# Altium schematic sheet interface.SchDoc
size A4
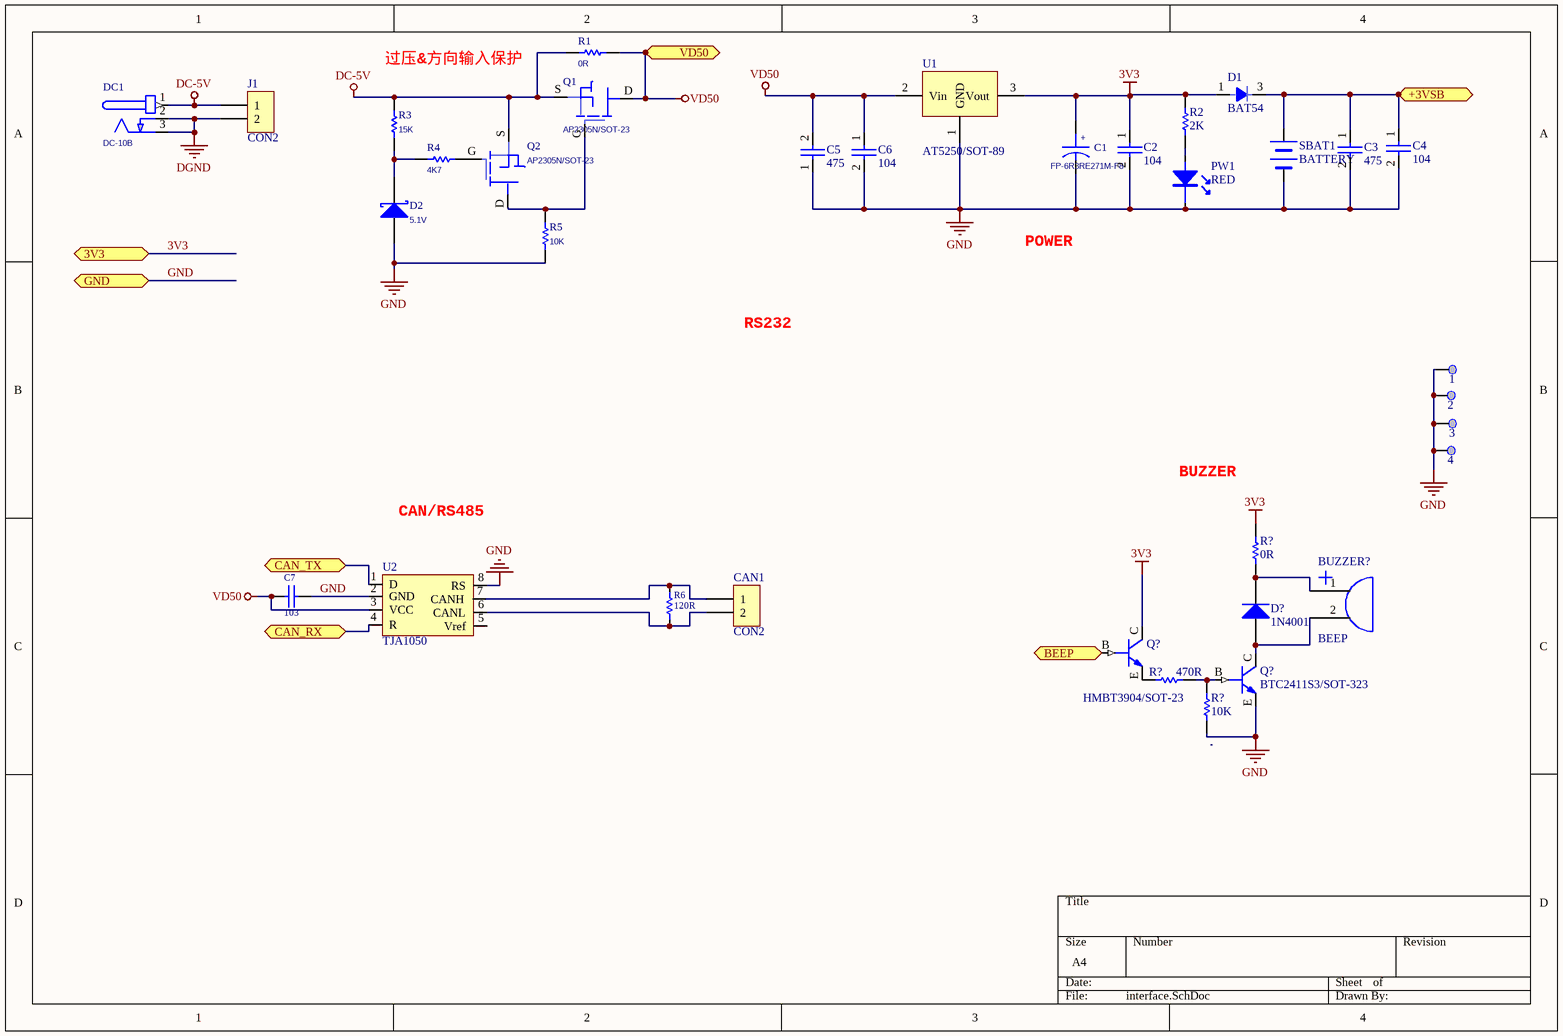
[diagram p0: interface.SchDoc]

## Parts
(Parts that share a designator on the sheet are numbered #1, #2 ... from top to bottom, then left to right.)
1  TP  [HOLE53]  (value not drawn)
2  TP  [HOLE53]  (value not drawn)
3  TP  [HOLE53]  (value not drawn)
4  TP  [HOLE53]  (value not drawn)
BUZZER?  BEEP  [BUZZER]
C1  FP-6R3RE271M-F8  [6R3RE271M]
C2  104  [0603C]
C3  475  [0805]
C4  104  [0603C]
C5  475  [0805]
C6  104  [0603C]
C7  103  [0603C]
CAN1  CON2  [INTERFACE-2]
D1  BAT54  [BAT54]
D2  5.1V  [SOD-123_1N5819HW]
D?  Type: 1N4001  [1N5819S]  (hidden comment: Diode)
DC1  DC-10B  [DC-JACK]
J1  CON2  [INTERFACE-2]
PW1  RED  [LED-0603]
Q1  AP2305N/SOT-23  [AP2305N_SOT23]
Q2  AP2305N/SOT-23  [AP2305N_SOT23]
Q?#1  HMBT3904/SOT-23  [SOT-23_HMBT3904]
Q?#2  BTC2411S3/SOT-323  [SOT-23_HMBT3904]
R1  0R  [0603C]
R2  2K  [0603C]
R3  15K  [0603C]
R4  4K7  [0603C]
R5  10K  [0603C]
R6  120R  [0805]
R?#1  0R  [0603C]
R?#2  470R  [0603C]
R?#3  10K  [0603C]
SBAT1  BATTERY  [LI1220_1]
U1  AT5250/SOT-89  [AT5250]
U2  TJA1050  [SOP-8]

## Ports
3V3, +3VSB, BEEP, CAN_RX, CAN_TX, GND, VD50

## Nets
3V3: C1.1 C2.1 D1.1 Q?#1.C(COLLECTOR) R2.1 R?#1.2 U1.3(Vout) ; port 3V3
DC-5V: DC1.1(+) J1.2(1) Q1.S Q2.S R1.2 R3.2
DGND: DC1.2(GND) DC1.3(GND) J1.1(2)
GND: 1.1 2.1 3.1 4.1 C1.2 C2.2 C3.2 C4.2 C5.1 C6.2 C7.2 D2.2(A) PW1.2 Q?#2.E(EMITTER) R5.1 R?#3.1 SBAT1.2 U1.1(GND) U2.2(GND) U2.8(RS) ; port GND
VD50: C5.2 C6.1 C7.1 Q1.D R1.1 U1.2(Vin) U2.3(VCC) ; port VD50
+3VSB: C3.1 C4.1 D1.3 SBAT1.1 ; port +3VSB
BEEP: Q?#1.B(BASE) ; port BEEP
CAN_RX: U2.4(R) ; port CAN_RX
CAN_TX: U2.1(D) ; port CAN_TX
NetBUZZER?_1: BUZZER?.1 D?.2(K) R?#1.1
NetBUZZER?_2: BUZZER?.2 D?.1(A) Q?#2.C(COLLECTOR)
NetCAN1_1: CAN1.1(2) R6.2 U2.6(CANL)
NetCAN1_2: CAN1.2(1) R6.1 U2.7(CANH)
NetD2_1: D2.1(K) R3.1 R4.2
NetPW1_1: PW1.1 R2.2
NetQ1_G: Q1.G Q2.D R5.2
NetQ2_G: Q2.G R4.1
NetQ?#1_E: Q?#1.E(EMITTER) R?#2.1
NetQ?#2_B: Q?#2.B(BASE) R?#2.2 R?#3.2

Not connected (* = marked no-connect by the designer): U2 5(Vref)

## Notes on the sheet
- (near R3) 过压&方向输入保护
- POWER
- RS232
- CAN/RS485
- BUZZER
- (in symbol CAP POL) +

## Library data of the parts
BUZZER? = BEEP: 蜂鸣器
C1 = CAP POL
C2-C6 = CAP: Capacitor
C7 = Cap: Capacitor; Published: *; Publisher: *; Manufacturer: *; Class: *; SubClass: *; C13: *
CAN1 J1 = CON2: Connector
D2 = Diode 10TQ035: Schottky Rectifier; Note: Terminal 2 is the TAB and is electrically connected to the cathode; Published: 8-Jun-2000; LatestRevisionDate: 17-Jul-2002; LatestRevisionNote: Re-released for DXP Platform.; DatasheetVersion: PD-2.057B; PackageVersion: Feb-1998; PackageReference: TO-220AC; Publisher: Altium Limited; PackageDescription: TO, Thru-Hole, Vertical, Heatsink Mounted; 3 In-Line Leads (1 Absent); Pitch 2.54 mm; ComponentLink1Description: Manufacturer Link; ComponentLink1URL: http://www.irf.com/; ComponentLink2Description: Datasheet; ComponentLink2URL: http://www.irf.com/product-info/datasheets/data/10tq.pdf
D? = Diode: 二极管; Published: 8-Jun-2000; LatestRevisionDate: 17-Jul-2002; LatestRevisionNote: Re-released for DXP Platform.; PackageDocument: Sep-1996; PackageReference: SMC; Publisher: Altium Limited; Code_JEDEC: DO-214-AB
DC1 = PJ202A
PW1 = LED
Q?#2 = HMBT3904/SOT-23
R1-R5 R?#1-R?#3 = res1: Resistor; Value: 1K; Published: 8-Jun-2000; Revision: July-2002: Re-released for DXP Platform.; Publisher: Altium Limited
R6 = Res1: Resistor; Published: *; Revision: *; Publisher: *; Value: *
U1 = XC62FP3302PR